# Altium schematic sheet IMU_ld.SchDoc
size A4
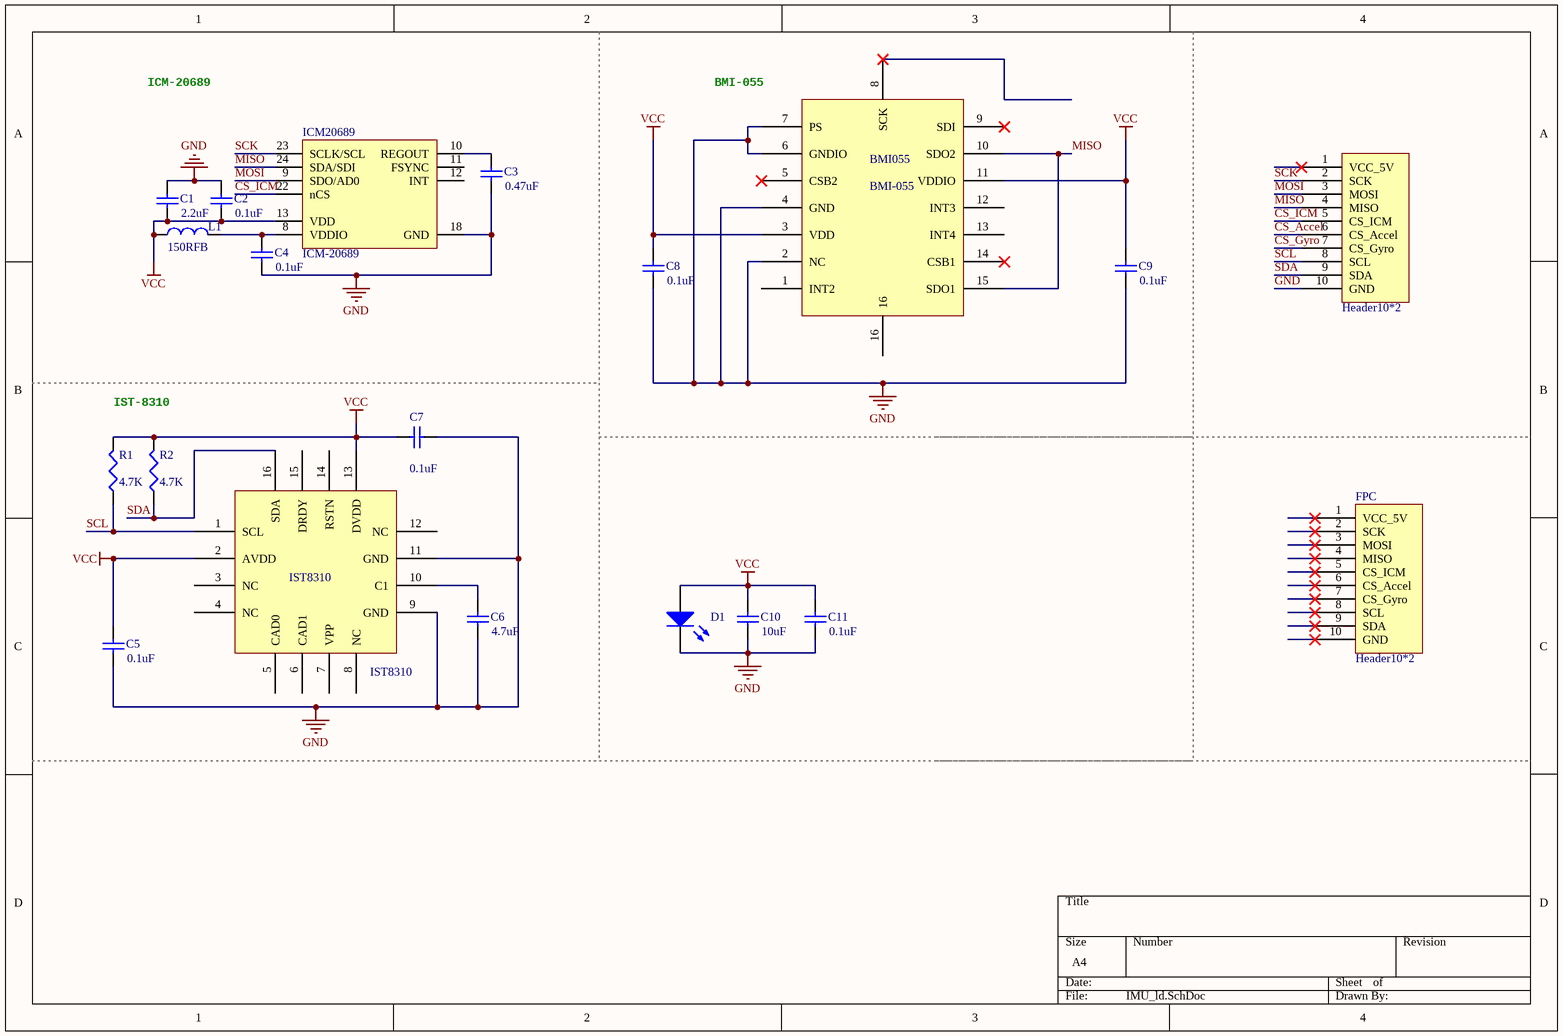
[diagram p0: IMU_ld.SchDoc]

## Parts
?  Header10*2  [HDR1X10]
BMI055  BMI-055  [BMI055]
C1  value 2.2uF  [0805-CAP]
C2  value 0.1uF  [0603-CAP]
C3  value 0.47uF  [0603-CAP]
C4  value 0.1uF  [0603-CAP]
C5  value 0.1uF  [0603-CAP]
C6  value 4.7uF  [0603-CAP]
C7  value 0.1uF  [0603-CAP]
C8  value 0.1uF  [0603-CAP]
C9  value 0.1uF  [0603-CAP]
C10  value 10uF  [0805-CAP]
C11  value 0.1uF  [0603-CAP]
D1  (no value)  [0805-LED]
FPC  Header10*2
ICM20689  ICM-20689  [QFN24]
IST8310  IST8310  [IST8310]
L1  150RFB  [R0603]
R1  value 4.7K  [0402-Res]
R2  value 4.7K  [0402-Res]

## Nets
GND: ?.10(GND) BMI055.2(NC) BMI055.4(GND) BMI055.6(GNDIO) BMI055.7(PS) C1.2 C2.2 C3.1 C4.1 C5.1 C6.1 C7.1 C8.1 C9.1 C10.1 C11.1 D1.2(K) ICM20689.18(GND) IST8310.9(GND) IST8310.11(GND)
VCC: BMI055.3(VDD) BMI055.11(VDDIO) C1.1 C2.1 C5.2 C7.2 C8.2 C9.2 C10.2 C11.2 D1.1(A) ICM20689.13(VDD) IST8310.2(AVDD) IST8310.13(DVDD) L1.1 R1.2 R2.2
CS_Accel: ?.6(CS_Accel)
CS_Gyro: ?.7(CS_Gyro)
CS_ICM: ?.5(CS_ICM) ICM20689.22(nCS)
MISO: ?.4(MISO) BMI055.10(SDO2) BMI055.15(SDO1) ICM20689.24(SDA/SDI)
MOSI: ?.3(MOSI) ICM20689.9(SDO/AD0)
SCK: ?.2(SCK) ICM20689.23(SCLK/SCL)
SCL: ?.8(SCL) IST8310.1(SCL) R1.1
SDA: ?.9(SDA) IST8310.16(SDA) R2.1
NetC3_2: C3.2 ICM20689.10(REGOUT)
NetC4_2: C4.2 ICM20689.8(VDDIO) L1.2
NetC6_2: C6.2 IST8310.10(C1)

Not connected (* = marked no-connect by the designer): ? 1(VCC_5V)*; BMI055 1(INT2) 5(CSB2)* 8(SCK)* 9(SDI)* 12(INT3) 13(INT4) 14(CSB1)* 16; FPC 1(VCC_5V)* 2(SCK)* 3(MOSI)* 4(MISO)* 5(CS_ICM)* 6(CS_Accel)* 7(CS_Gyro)* 8(SCL)* 9(SDA)* 10(GND)*; ICM20689 11(FSYNC) 12(INT); IST8310 3(NC) 4(NC) 5(CAD0) 6(CAD1) 7(VPP) 8(NC) 12(NC) 14(RSTN) 15(DRDY)

## Notes on the sheet
- ICM-20689
- (near BMI055) BMI-055
- IST-8310

## Library data of the parts
C1-C11 = Cap Semi: Capacitor (Semiconductor SIM Model); Published: 8-Jun-2000; LatestRevisionDate: 29-May-2009; LatestRevisionNote: IPC-7351 Footprint Added.; PackageReference: C1206; Publisher: Altium Limited; PackageDescription: Chip Capacitor
D1 = LED2: Typical RED, GREEN, YELLOW, AMBER GaAs LED; Published: 8-Jun-2000; LatestRevisionDate: 17-Jul-2002; LatestRevisionNote: Re-released for DXP Platform.; PackageVersion: Feb-2002; PackageReference: 3.2X1.6X1.1; Publisher: Altium Limited; PackageDescription: SM LED; 2 Flat Leads
L1 = inductors
R1 R2 = Res3: Resistor; Published: 8-Jun-2000; LatestRevisionDate: 29-May-2009; LatestRevisionNote: IPC-7351 Footprint Added.; PackageReference: J1-0603; Publisher: Altium Limited; PackageDescription: Chip Resistor